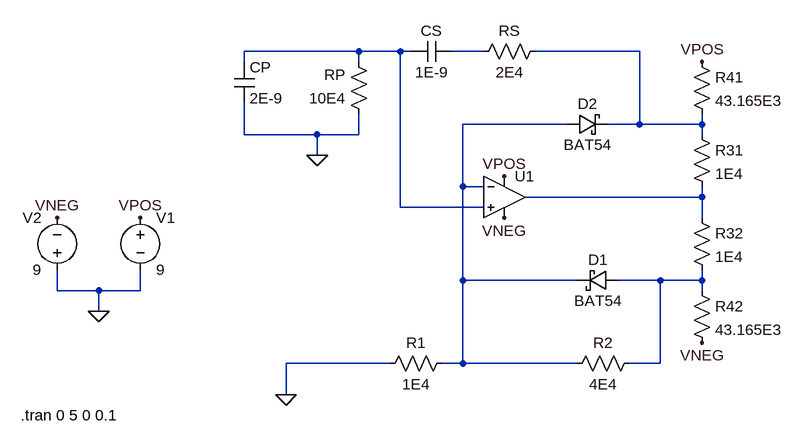
[diagram p0: schematic 10-4.asc]
10-4.asc, the LTspice schematic file:
Version 4
SHEET 1 880 680
WIRE -48 -64 -224 -64
WIRE 16 -64 -48 -64
WIRE 32 -64 16 -64
WIRE 144 -64 96 -64
WIRE 384 -64 224 -64
WIRE -224 -48 -224 -64
WIRE -48 -48 -48 -64
WIRE 272 48 112 48
WIRE 384 48 384 -64
WIRE 384 48 336 48
WIRE 480 48 480 32
WIRE 480 48 384 48
WIRE -224 64 -224 16
WIRE -112 64 -224 64
WIRE -48 64 -48 32
WIRE -48 64 -112 64
WIRE 480 64 480 48
WIRE -112 96 -112 64
WIRE 112 144 112 48
WIRE 144 144 112 144
WIRE 480 160 480 144
WIRE 480 160 208 160
WIRE 16 176 16 -64
WIRE 144 176 16 176
WIRE 480 192 480 160
WIRE 112 288 112 144
WIRE 288 288 112 288
WIRE 416 288 352 288
WIRE 480 288 480 272
WIRE 480 288 416 288
WIRE -512 304 -512 272
WIRE -448 304 -512 304
WIRE -384 304 -384 272
WIRE -384 304 -448 304
WIRE 480 304 480 288
WIRE -448 336 -448 304
WIRE 0 416 -160 416
WIRE 112 416 112 288
WIRE 112 416 80 416
WIRE 288 416 112 416
WIRE 416 416 416 288
WIRE 416 416 368 416
WIRE -160 464 -160 416
FLAG -112 96 0
FLAG -160 464 0
FLAG -448 336 0
FLAG -384 192 VPOS
FLAG 176 128 VPOS
FLAG -512 192 VNEG
FLAG 176 192 VNEG
FLAG 480 -48 VPOS
FLAG 480 384 VNEG
SYMBOL schottky 352 272 R90
WINDOW 0 0 32 VBottom 2
WINDOW 3 32 32 VTop 2
SYMATTR InstName D1
SYMATTR Value BAT54
SYMATTR Description Diode
SYMATTR Type diode
SYMBOL schottky 272 64 R270
WINDOW 0 32 32 VTop 2
WINDOW 3 0 32 VBottom 2
SYMATTR InstName D2
SYMATTR Value BAT54
SYMATTR Description Diode
SYMATTR Type diode
SYMBOL cap -240 -48 R0
SYMATTR InstName CP
SYMATTR Value 2E-9
SYMBOL cap 96 -80 R90
WINDOW 0 0 32 VBottom 2
WINDOW 3 32 32 VTop 2
SYMATTR InstName CS
SYMATTR Value 1E-9
SYMBOL res 240 -80 R90
WINDOW 0 0 56 VBottom 2
WINDOW 3 32 56 VTop 2
SYMATTR InstName RS
SYMATTR Value 2E4
SYMBOL res -32 48 R180
WINDOW 0 36 76 Left 2
WINDOW 3 36 40 Left 2
SYMATTR InstName RP
SYMATTR Value 10E4
SYMBOL res 272 432 R270
WINDOW 0 32 56 VTop 2
WINDOW 3 0 56 VBottom 2
SYMATTR InstName R2
SYMATTR Value 4E4
SYMBOL res -16 432 R270
WINDOW 0 32 56 VTop 2
WINDOW 3 0 56 VBottom 2
SYMATTR InstName R1
SYMATTR Value 1E4
SYMBOL res 464 -64 R0
SYMATTR InstName R41
SYMATTR Value 43.165E3
SYMBOL res 464 48 R0
SYMATTR InstName R31
SYMATTR Value 1E4
SYMBOL res 464 176 R0
SYMATTR InstName R32
SYMATTR Value 1E4
SYMBOL res 464 288 R0
SYMATTR InstName R42
SYMATTR Value 43.165E3
SYMBOL Opamps\\UniversalOpamp2 176 160 R0
SYMATTR InstName U1
SYMBOL voltage -384 176 R0
SYMATTR InstName V1
SYMATTR Value 9
SYMBOL voltage -512 288 R180
WINDOW 0 24 96 Left 2
WINDOW 3 24 16 Left 2
SYMATTR InstName V2
SYMATTR Value 9
TEXT -568 496 Left 2 !.tran 0 5 0 0.1

The netlist it stands for:
* 10-4.asc
D1 N006 N004 BAT54
D2 N004 N003 BAT54
CP N001 0 2E-9
CS N002 N001 1E-9
RS N003 N002 2E4
RP 0 N001 10E4
R2 N004 N006 4E4
R1 0 N004 1E4
R41 VPOS N003 43.165E3
R31 N003 N005 1E4
R32 N005 N006 1E4
R42 N006 VNEG 43.165E3
XU1 N001 N004 VPOS VNEG N005 level.2 Avol=1Meg GBW=10Meg Slew=10Meg ilimit=25m rail=0 Vos=0 phimargin=45 en=0 enk=0 in=0 ink=0 Rin=500Meg  ; pins IN+ IN- V+ V- OUT
V1 VPOS 0 9
V2 0 VNEG 9
.model D D
.lib standard.dio
.tran 0 5 0 0.1
.lib UniversalOpamps2.sub
.backanno
.end